# EasyEDA Pro project tachyon.eprj, schematic backing-board-schematic

## Sheets
1 MCU: Board Name: backing-board; Create Date: 2026-04-17; Page Name: MCU; Project Name: tachyon; Schematic Name: backing-board-schematic; Update Date: 2026-04-29; Company: EasyEDA.com; Page Size: A4; Version: V1.0
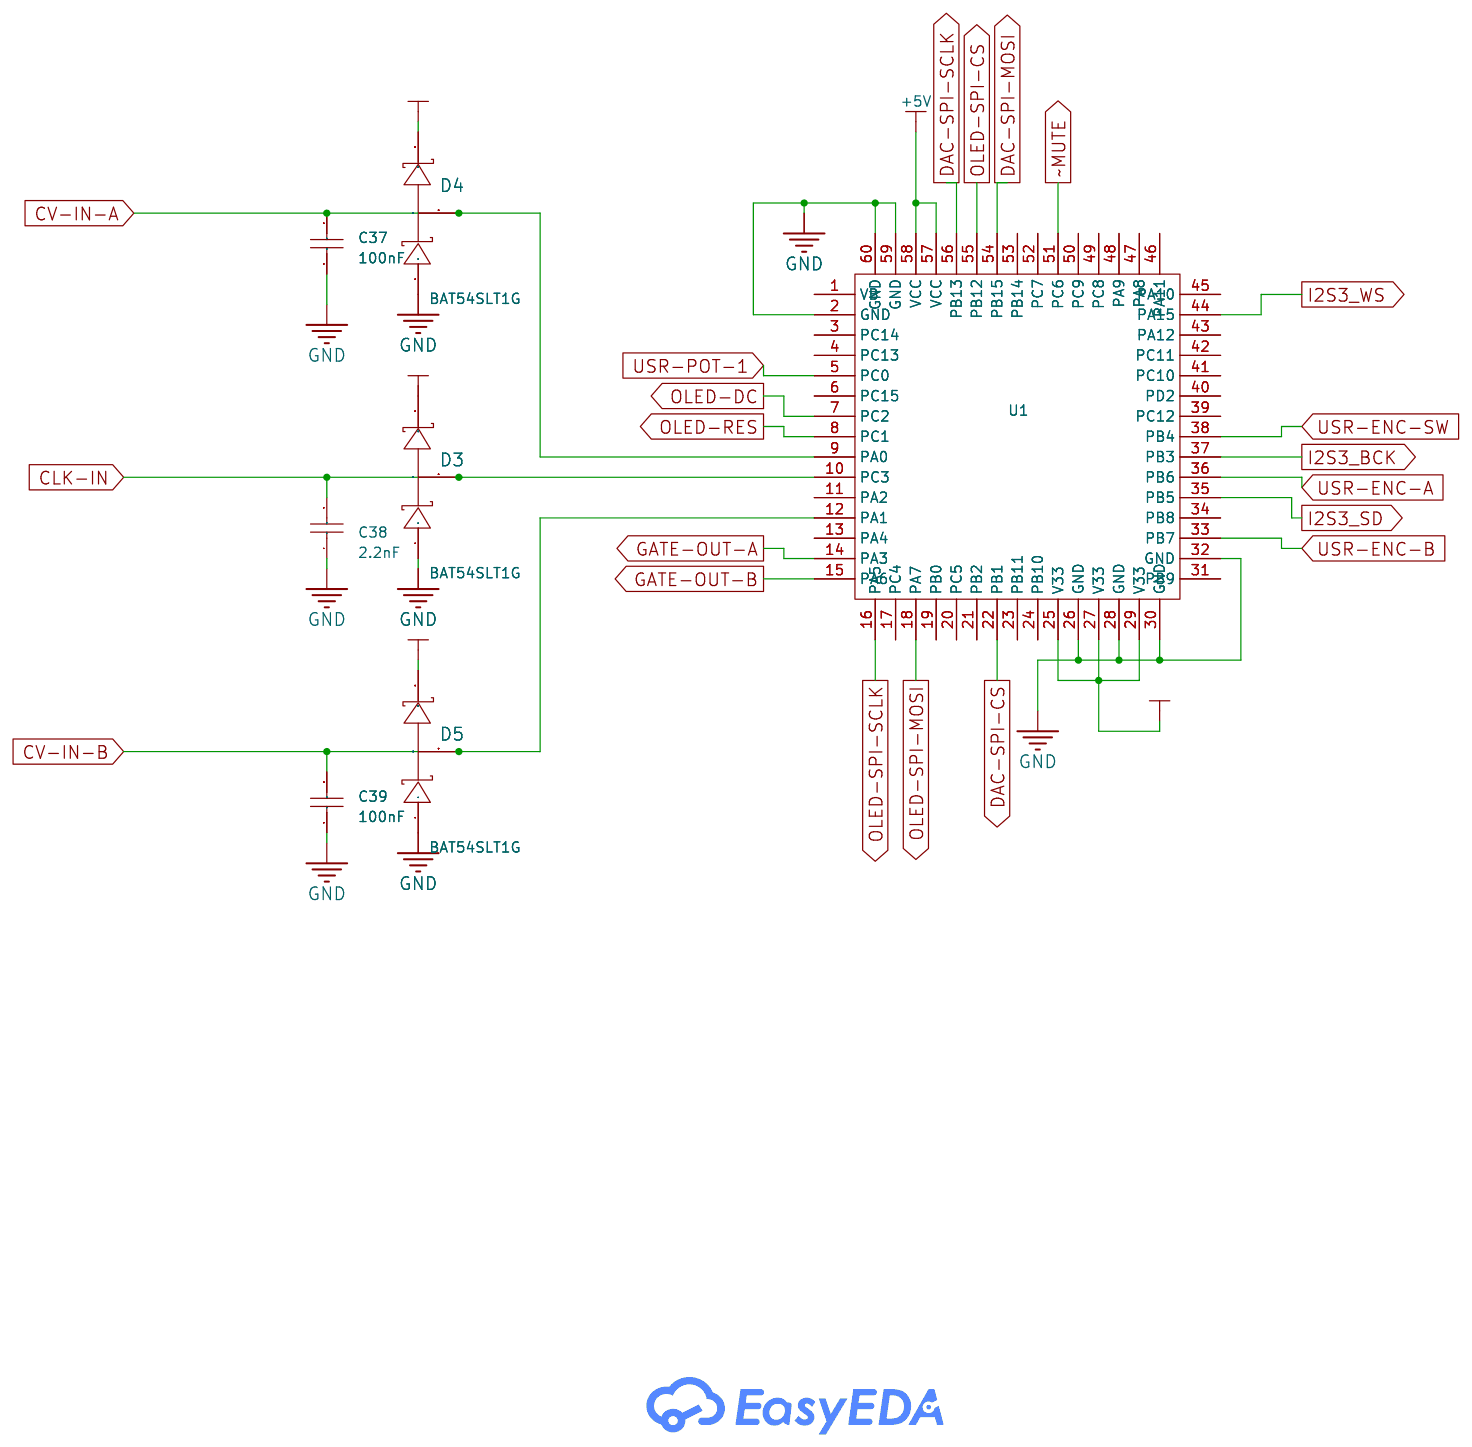
[diagram p2: MCU]
2 Audio: Page Name: Audio; Update Date: 2026-04-20
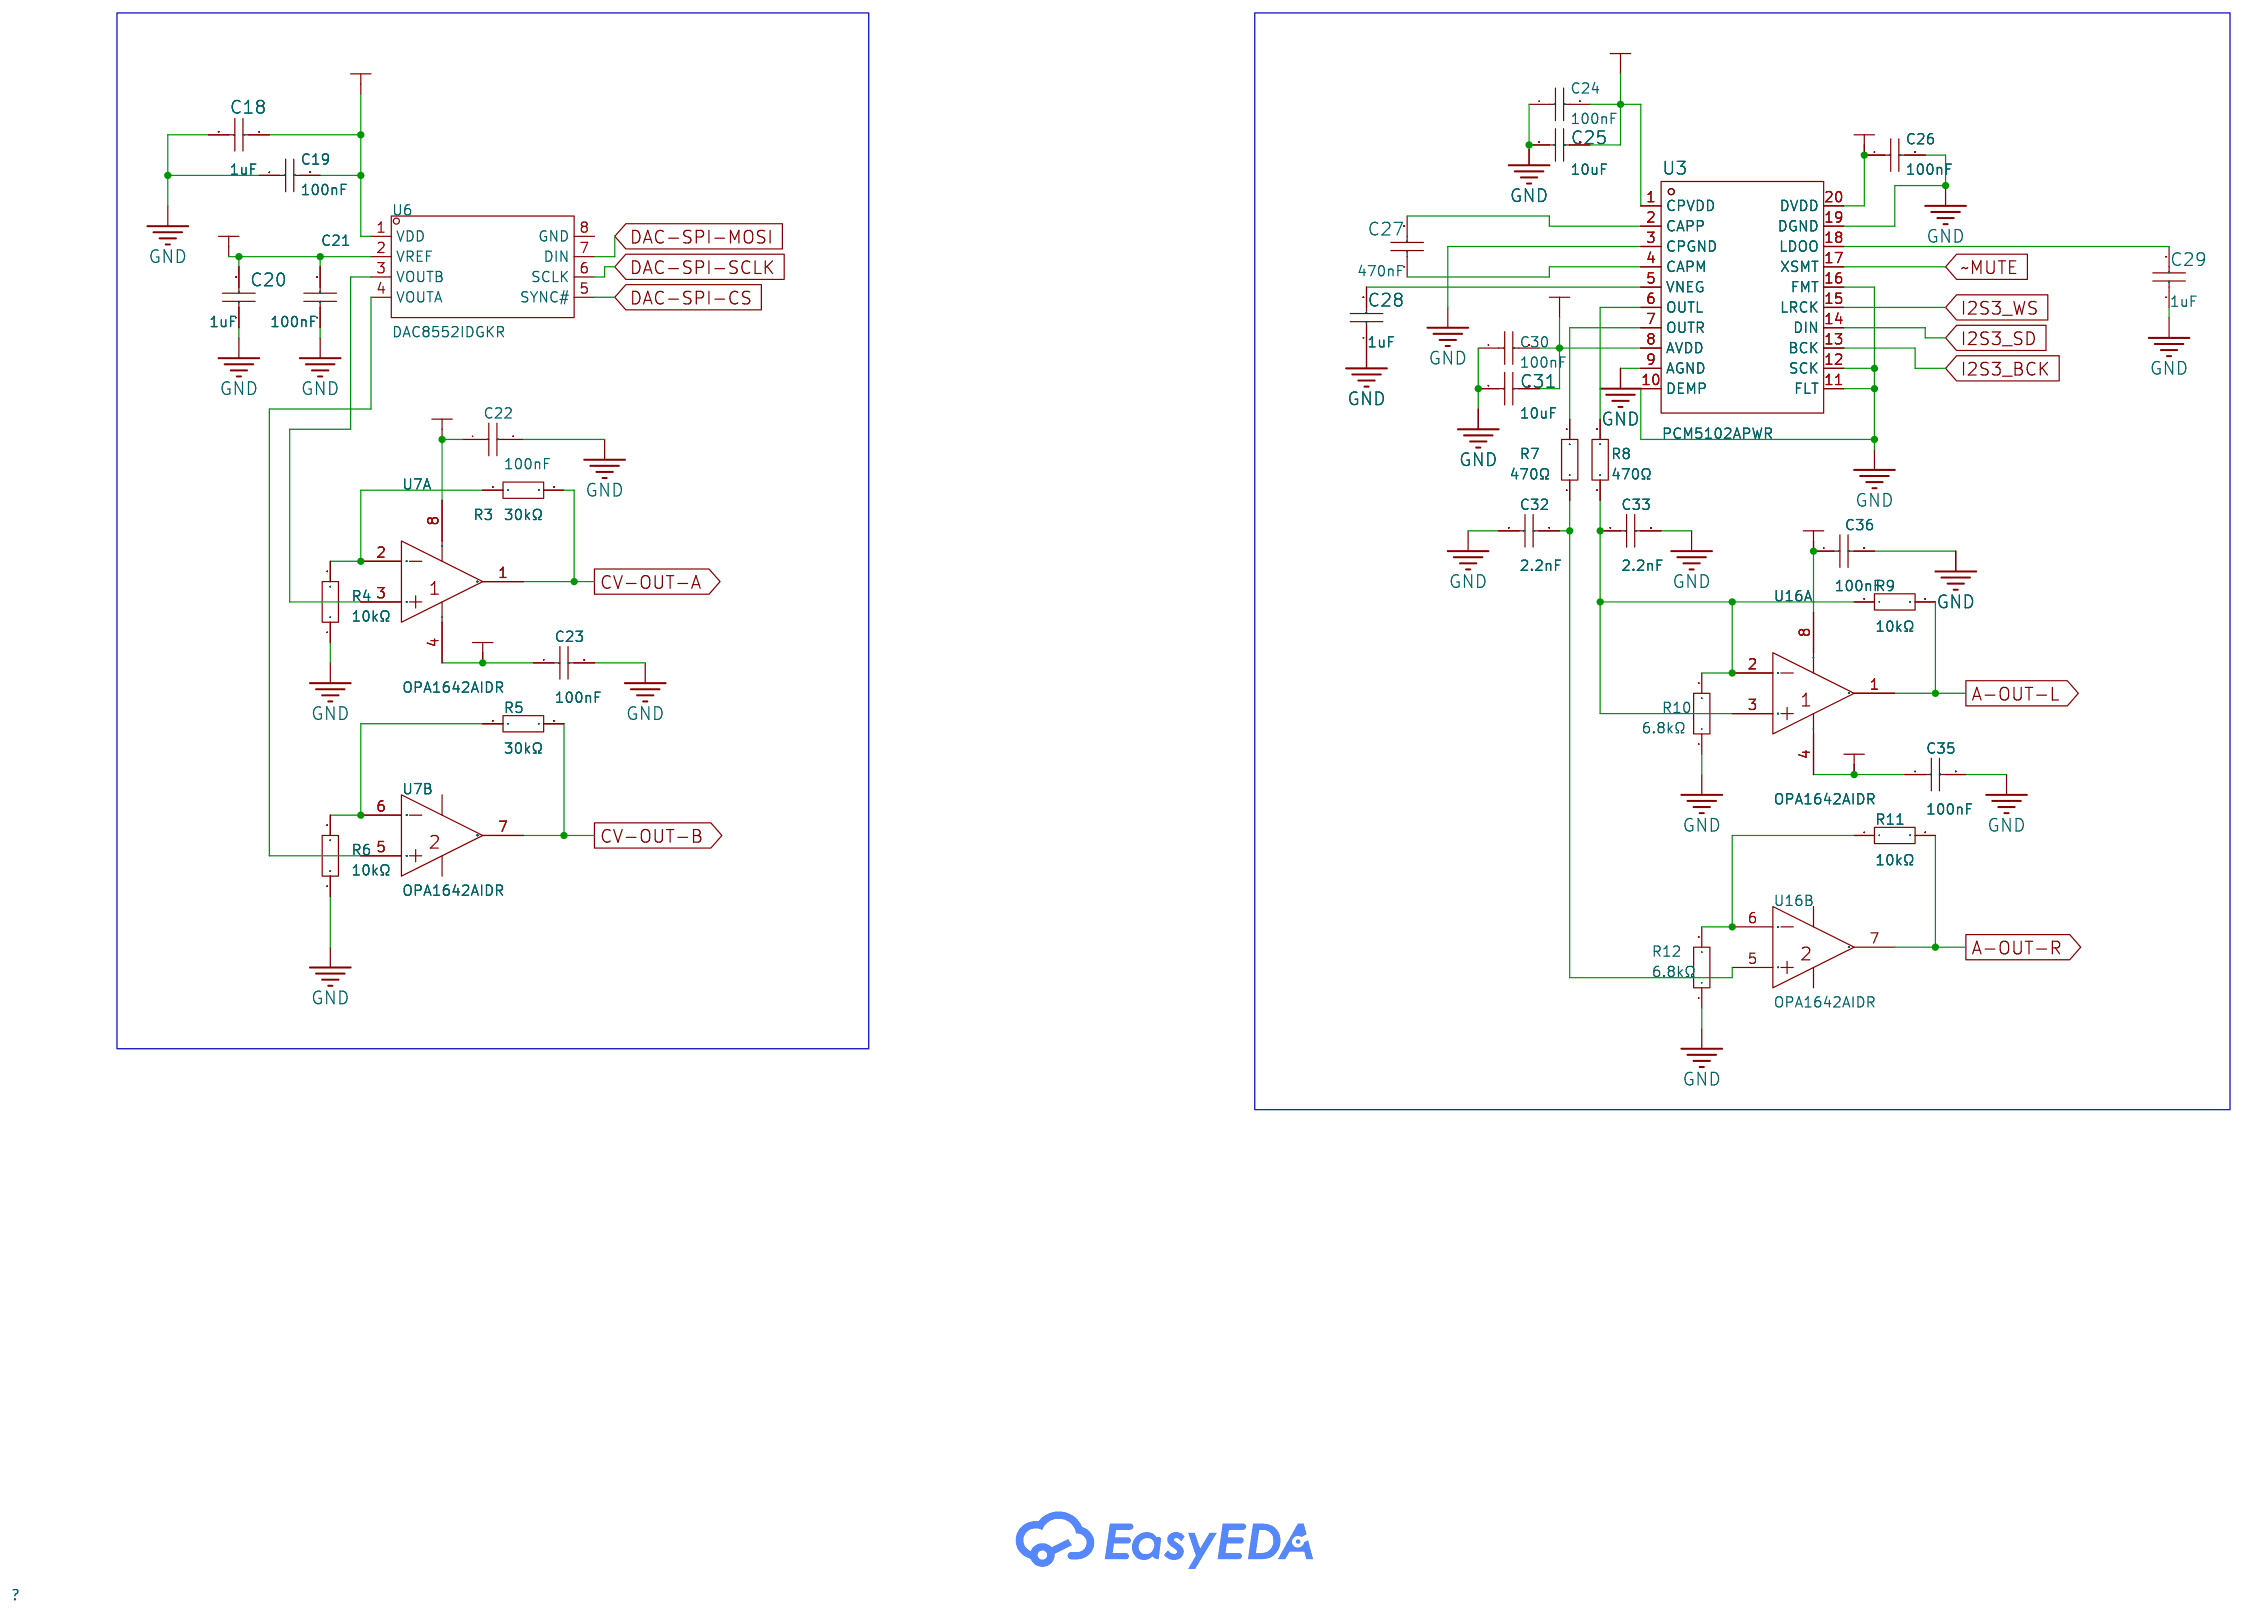
[diagram p3: Audio]
3 Interconnect: Page Name: Interconnect; Update Date: 2026-04-21
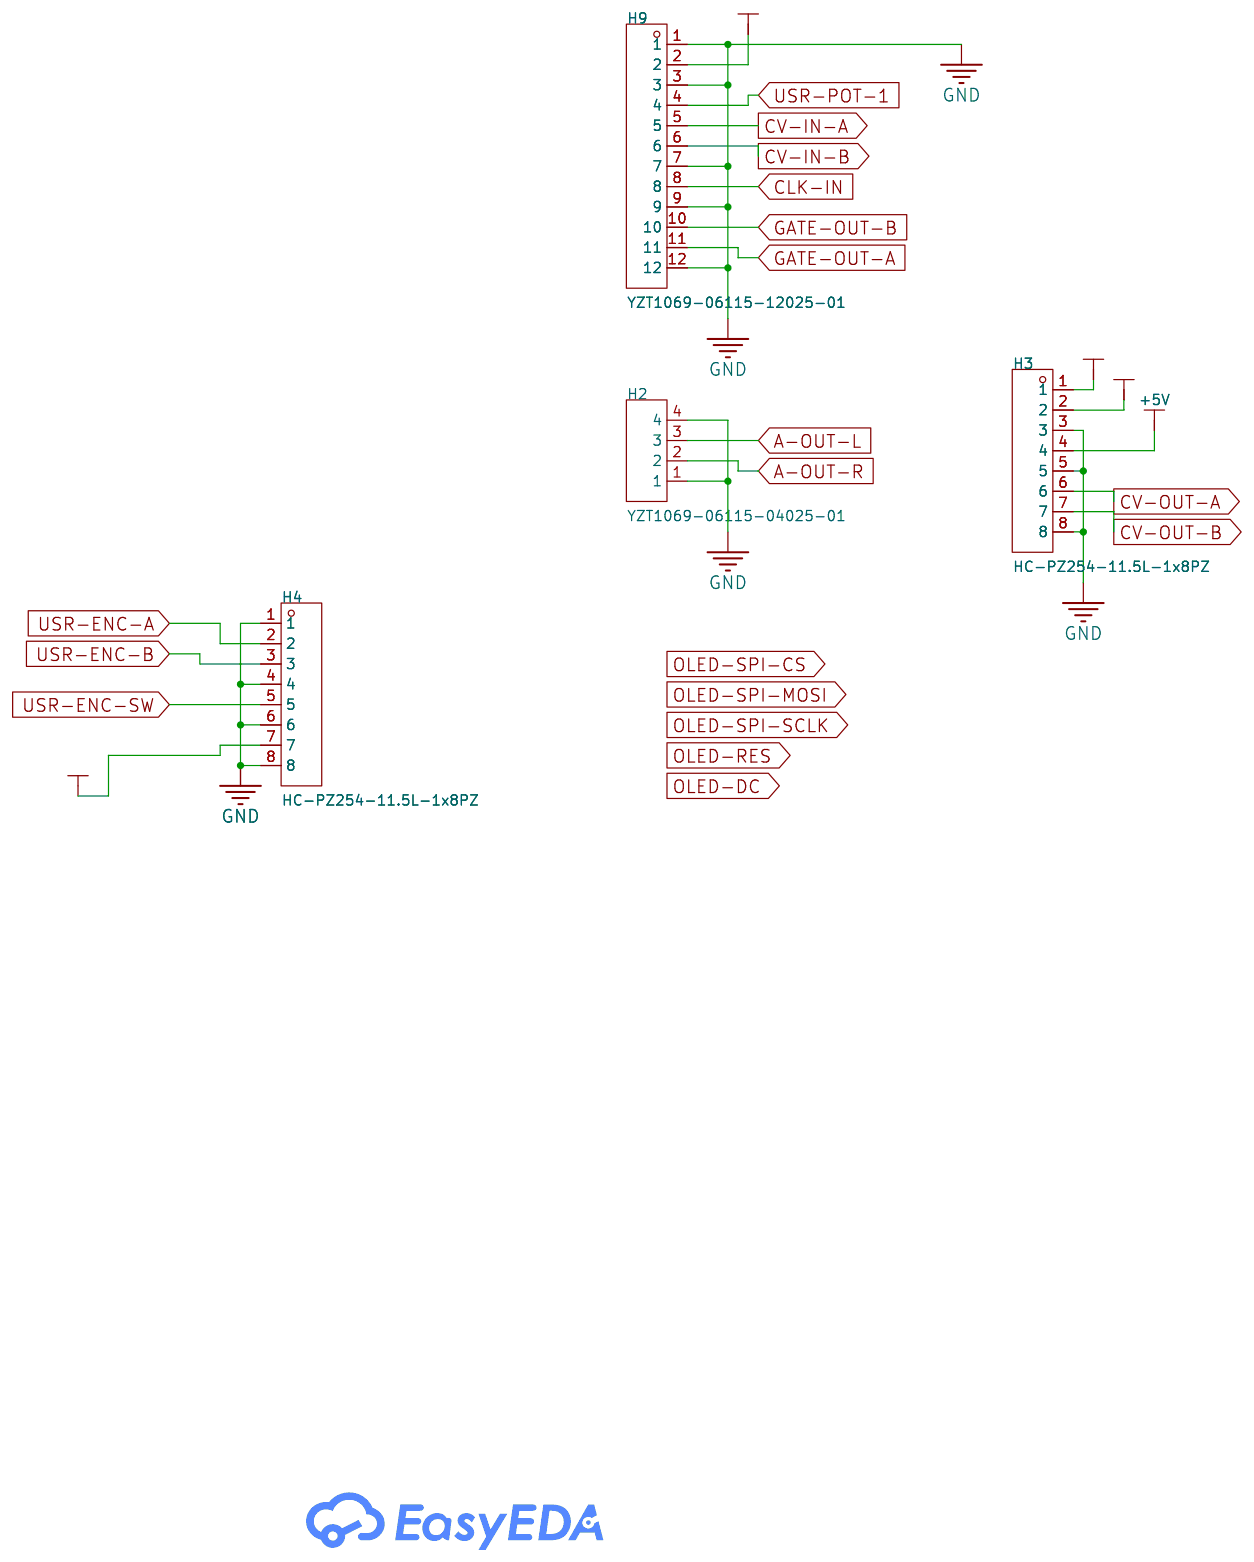
[diagram p4: Interconnect]
4 Power: Page Name: Power; Update Date: 2026-04-19
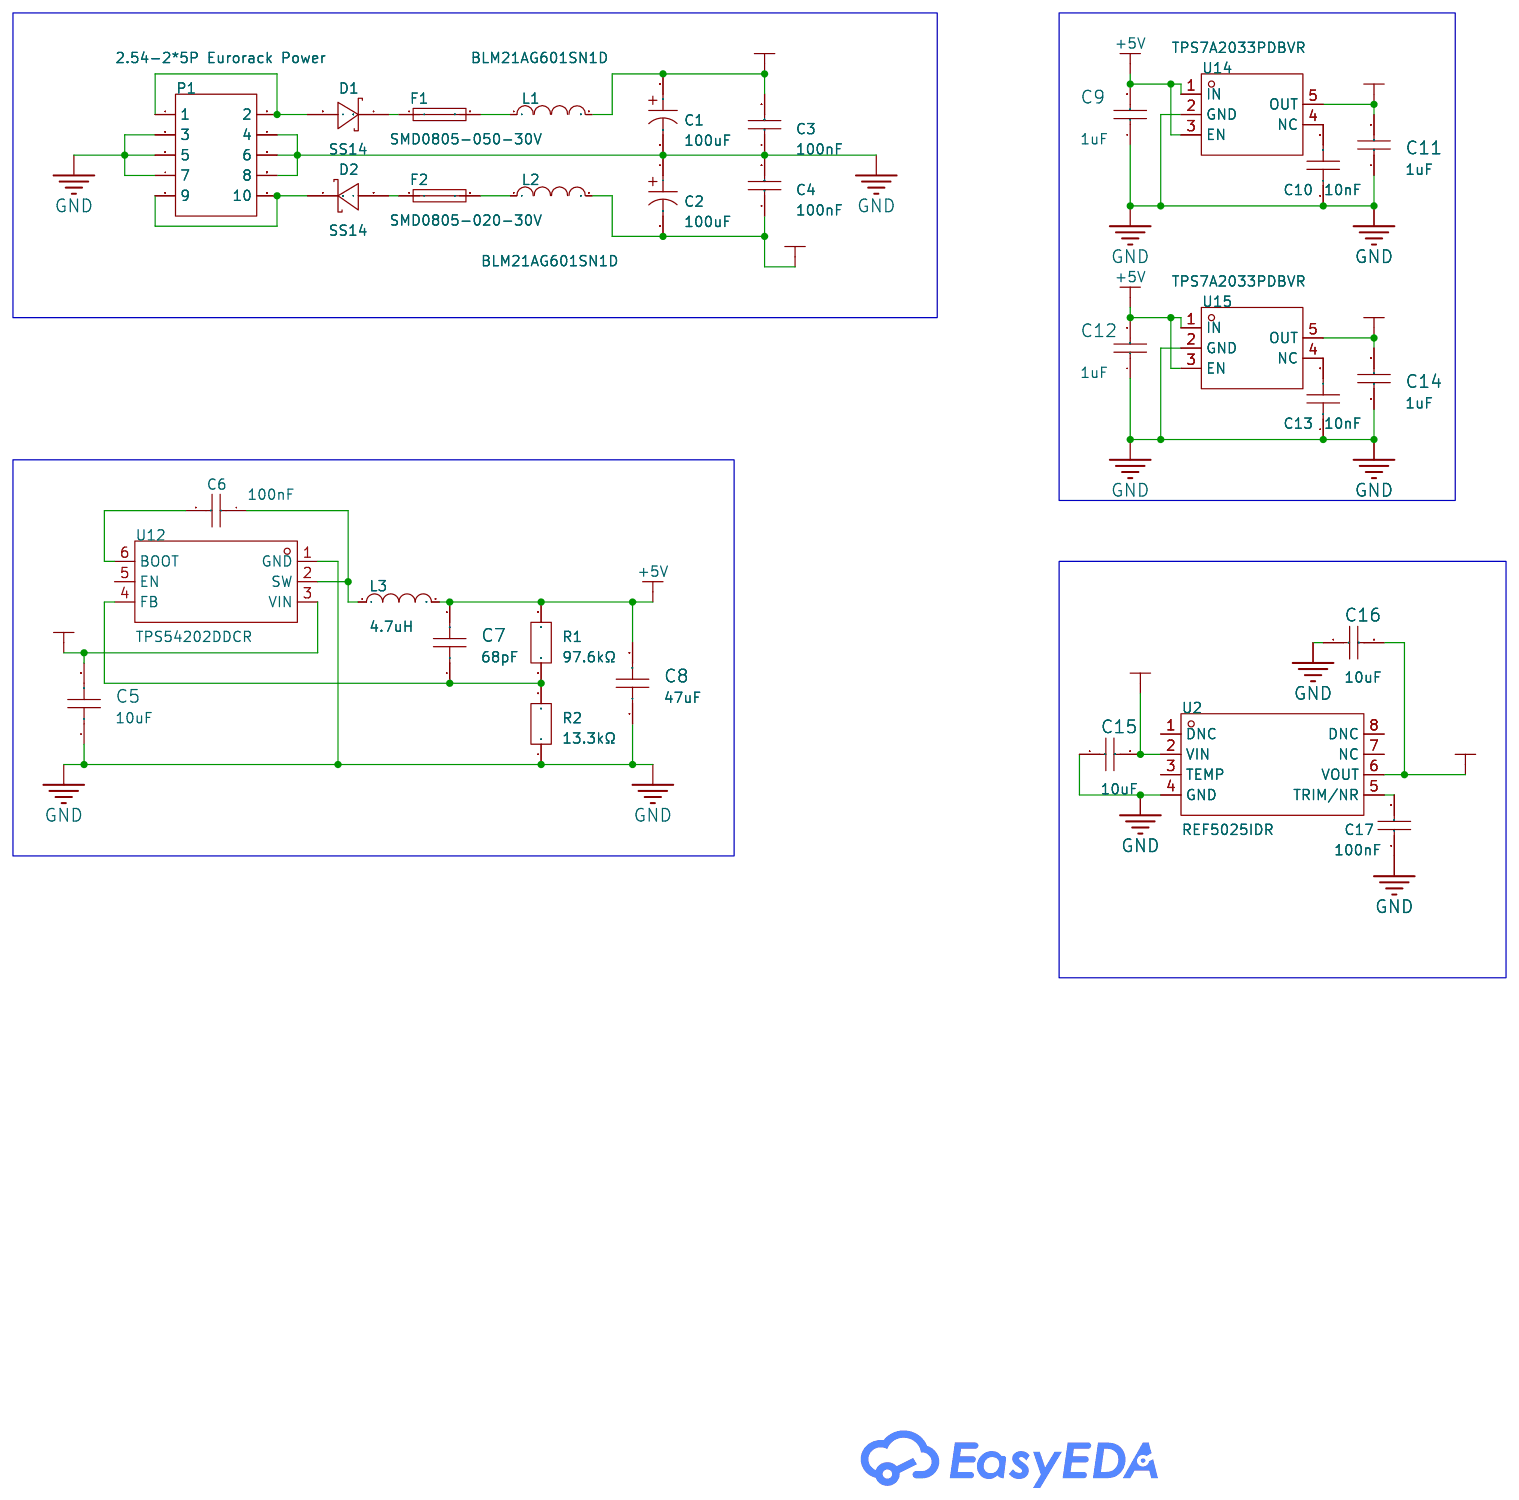
[diagram p5: Power]

## Parts
sheet Audio
C18  1uF  [C0805]
C19  100nF  [C0805]
C20  1uF  [C0805]
C21  100nF  [C0805]
C22  100nF  [C0805]
C23  100nF  [C0805]
C24  100nF  [C0805]
C25  10uF  [C0805]
C26  100nF  [C0805]
C27  470nF  [C0805]
C28  1uF  [C0805]
C29  1uF  [C0805]
C30  100nF  [C0805]
C31  10uF  [C0805]
C32  2.2nF  [C0805]
C33  2.2nF  [C0805]
C35  100nF  [C0805]
C36  100nF  [C0805]
R3  30kΩ  [R0805]
R4  10kΩ  [R0805]
R5  30kΩ  [R0805]
R6  10kΩ  [R0805]
R7  470Ω  [R0805]
R8  470Ω  [R0805]
R9  10kΩ  [R0805]
R10  6.8kΩ  [R0805]
R11  10kΩ  [R0805]
R12  6.8kΩ  [R0805]
U3  PCM5102APWR  [TSSOP-20_L6.5-W4.4-P0.65-LS6.4-BL]
U6  DAC8552IDGKR  [VSSOP-8_L3.0-W3.0-P0.65-LS5.0-BL]
U7  OPA1642AIDR  [SOIC-8_L4.9-W3.9-P1.27-LS6.0-BL]  (sections 1,2)
U16  OPA1642AIDR  [SOIC-8_L4.9-W3.9-P1.27-LS6.0-BL]  (sections 1,2)
sheet Interconnect
H2  YZT1069-06115-04025-01  [HDR-TH_4P-P2.54-V-M-1]
H3  HC-PZ254-11.5L-1x8PZ  [HDR-TH_8P-P2.54-V-M]
H4  HC-PZ254-11.5L-1x8PZ  [HDR-TH_8P-P2.54-V-M]
H9  YZT1069-06115-12025-01  [HDR-TH_12P-P2.54-V-M]
sheet MCU
C37  100nF  [C0805]
C38  2.2nF  [C0805]
C39  100nF  [C0805]
D3  BAT54SLT1G  [SOT-23_L2.9-W1.3-P1.90-LS2.4-BR]
D4  BAT54SLT1G  [SOT-23_L2.9-W1.3-P1.90-LS2.4-BR]
D5  BAT54SLT1G  [SOT-23_L2.9-W1.3-P1.90-LS2.4-BR]
U1  WeAct-STM32F405RGT6  [Library:WeAct STM32F405RGT6]
sheet Power
C1  100uF  [CAP-SMD_BD6.3-L6.6-W6.6-LS7.2-FD]
C2  100uF  [CAP-SMD_BD6.3-L6.6-W6.6-LS7.2-FD]
C3  100nF  [C0805]
C4  100nF  [C0805]
C5  10uF  [C0805]
C6  100nF  [C0805]
C7  68pF  [C0805]
C8  47uF  [C1210]
C9  1uF  [C0805]
C10  10nF  [C0805]
C11  1uF  [C0805]
C12  1uF  [C0805]
C13  10nF  [C0805]
C14  1uF  [C0805]
C15  10uF  [C0805]
C16  10uF  [C0805]
C17  100nF  [C0805]
D1  SS14  [SMA_L4.4-W2.6-LS5.0-RD]
D2  SS14  [SMA_L4.4-W2.6-LS5.0-RD]
F1  SMD0805-050-30V  [F0805]
F2  SMD0805-020-30V  [F0805]
L1  BLM21AG601SN1D  [L0805]
L2  BLM21AG601SN1D  [L0805]
L3  4.7uH  [IND-SMD_L2.5-W2.0_MPB252012T]
P1  2.54-2*5P Eurorack Power  [IDC-TH_10P-P2.54_C5665]
R1  97.6kΩ  [R0805]
R2  13.3kΩ  [R0805]
U2  REF5025IDR  [SOIC-8_L4.9-W3.9-P1.27-LS6.0-BL-4]
U12  TPS54202DDCR  [SOT-23-6_L2.9-W1.6-P0.95-LS2.8-BL]
U14  TPS7A2033PDBVR  [SOT-23-5_L2.9-W1.6-P0.95-LS2.8-BR]
U15  TPS7A2033PDBVR  [SOT-23-5_L2.9-W1.6-P0.95-LS2.8-BR]

## Library data of the parts
C9 C11 C12 C14 C18 C20 C28 C29 = CC0805KKX7R9BB105: Capacitance: Tolerance:±10% Tolerance:±10% Voltage Rated: Temperature Coefficient:; LCSC Part Name: 1uF ±10% 50V; Supplier Part: C91185; Manufacturer: YAGEO(国巨); Supplier Footprint: 0805; JLCPCB Part Class: Extended Part; Datasheet: https://atta.szlcsc.com/upload/public/pdf/source/20181008/C309510_22F155564471FAF6A489F7D68F34234E.pdf; Supplier: LCSC; Tolerance: ±10%
C3 C4 C6 C17 C19 C21-C24 C26 C30 C35-C37 C39 = CL21B104KBCNNNC: Capacitance:100nF Tolerance:±10% Tolerance:±10% Voltage Rating:50V Temperature Coefficient:X7R; LCSC Part Name: 100nF ±10% 50V; Supplier Part: C1711; Manufacturer: SAMSUNG(三星); Supplier Footprint: 0805; JLCPCB Part Class: Extended Part; Datasheet: https://item.szlcsc.com/datasheet/CL21B104KBCNNNC/2063.html; Supplier: LCSC; Tolerance: ±10%; Voltage Rating: 50V; Temperature Coefficient: X7R
C15 C16 C25 C31 = CL21A106KOQNNNE: Capacitance:10uF Tolerance:±10% Tolerance:±10% Voltage Rating:16V Temperature Coefficient:X5R; LCSC Part Name: 10uF ±10% 16V; Supplier Part: C1713; Manufacturer: SAMSUNG(三星); Supplier Footprint: 0805; JLCPCB Part Class: Extended Part; Datasheet: https://item.szlcsc.com/datasheet/CL21A106KOQNNNE/2065.html; Supplier: LCSC; Tolerance: ±10%; Voltage Rating: 16V; Temperature Coefficient: X5R
C27 = CC0805KKX7R9BB105: Capacitance: Tolerance:±10% Tolerance:±10% Voltage Rated: Temperature Coefficient:; LCSC Part Name: 1uF ±10% 50V; Supplier Part: C106843; Manufacturer: YAGEO(国巨); Manufacturer Part: CC0805KKX7R9BB474; Supplier Footprint: 0805; JLCPCB Part Class: Extended Part; Datasheet: https://atta.szlcsc.com/upload/public/pdf/source/20181008/C309510_22F155564471FAF6A489F7D68F34234E.pdf; Supplier: LCSC; Tolerance: ±10%
C32 C33 = CC0805JKNPO9BN222: LCSC Part Name: 2.2nF ±5% 50V; Supplier Part: C107103; Manufacturer: YAGEO(国巨); Supplier Footprint: 0805; JLCPCB Part Class: Extended Part; Datasheet: https://item.szlcsc.com/datasheet/CC0805JKNPO9BN222/108319.html; Supplier: LCSC; Tolerance: ±5%; Voltage Rating: 50V; Temperature Coefficient: NP0
R3 R5 = AC0805FR-0730KL: LCSC Part Name: 厚膜电阻 30kΩ ±1% 125mW; Supplier Part: C144565; Manufacturer: YAGEO(国巨); Supplier Footprint: 0805; JLCPCB Part Class: Extended Part; Datasheet: https://atta.szlcsc.com/upload/public/pdf/source/20180927/C229861_4ABDC471507C1ED6AFB4BA66AFC8620A.pdf; Supplier: LCSC; Type: Thick Film Resistors; Tolerance: ±1%; Temperature Coefficient: ±100ppm/℃; Operating Temperature Range: -55℃~+155℃
R4 R6 R9 R11 = AC0805FR-0710KL: LCSC Part Name: 厚膜电阻 10kΩ ±1% 125mW; Supplier Part: C140868; Manufacturer: YAGEO(国巨); Supplier Footprint: 0805; JLCPCB Part Class: Extended Part; Datasheet: https://item.szlcsc.com/datasheet/AC0805FR-0710KL/152196.html; Supplier: LCSC; Type: Thick Film Resistor; Tolerance: ±1%; Power(Watts): 125mW; Voltage-Supply(Max): 150V; Temperature Coefficient: ±100ppm/℃; Operating Temperature: -55℃~+155℃
R7 R8 = AC0805FR-07470RL: LCSC Part Name: 厚膜电阻 470Ω ±1% 125mW; Supplier Part: C144560; Manufacturer: YAGEO(国巨); Supplier Footprint: 0805; JLCPCB Part Class: Extended Part; Datasheet: https://item.szlcsc.com/datasheet/AC0805FR-07470RL/155892.html; Supplier: LCSC; Type: Thick Film Resistor; Tolerance: ±1%; Power(Watts): 125mW; Voltage-Supply(Max): 150V; Temperature Coefficient: ±100ppm/℃; Operating Temperature: -55℃~+155℃
R10 R12 = AC0805FR-076K8L: LCSC Part Name: 厚膜电阻 6.8kΩ ±1% 125mW; Supplier Part: C144547; Manufacturer: YAGEO(国巨); Supplier Footprint: 0805; JLCPCB Part Class: Extended Part; Datasheet: https://atta.szlcsc.com/upload/public/pdf/source/20180927/C229861_4ABDC471507C1ED6AFB4BA66AFC8620A.pdf; Supplier: LCSC; Type: Thick Film Resistors; Tolerance: ±1%; Temperature Coefficient: ±100ppm/℃; Operating Temperature Range: -55℃~+155℃
U3 = PCM5102APWR: Interface Type:PCM Supply Voltage:1.65V~3.46V Supply Voltage:1.65V~3.46V Number of Channels:2 Resolution:24；16；32 Operating Temperature:-25℃~+85℃ Operating Temperature:-25℃~+85℃; Supplier Part: C107671; Manufacturer: TI(德州仪器); Supplier Footprint: TSSOP-20; JLCPCB Part Class: Extended Part; Datasheet: https://www.ti.com/cn/lit/gpn/pcm5102a; Supplier: LCSC; Interface Type: PCM; Supply Voltage: 1.65V~3.46V; Number of Channels: 2; Resolution: 24；16；32; Operating Temperature: -25℃~+85℃
U6 = DAC8552IDGKR: Resolution(Bits):16 Number of Channels:2 Interface:SPI Voltage - Supply:2.7V~5.5V Voltage - Supply:2.7V~5.5V Settling Time:10us Output Type:Voltage Buffer Integral non - linearity:4LSB Integral non - linearity:4LSB Operating Temperature:-40℃~+105℃ Operati; LCSC Part Name: 16位、双通道、电压输出数模转换器; Supplier Part: C136020; Manufacturer: TI(德州仪器); Supplier Footprint: MSOP-8; JLCPCB Part Class: Extended Part; Datasheet: https://www.ti.com/cn/lit/gpn/dac8552; Supplier: LCSC; Resolution(Bits): 16; Number of Channels: 2; Interface: SPI; Voltage - Supply: 2.7V~5.5V; Settling Time: 10us; Output Type: Voltage Buffer; Integral non - linearity: 4LSB; Operating Temperature: -40℃~+105℃; Power-On Reset: Built-in; Voltage Reference: External; Quiescent Current (Iq): 700nA
U7 U16 = OPA1642AIDR: Class:- Speaker Channels:2-Channel Output Power:- Total Harmonic Distortion + Noise (THD+N):0.00005% Quiescent Current:1.8mA Signal-to-Noise Ratio:- Power Supply Rejection Ratio (PSRR):- Efficiency:- Number of Inputs:2 Pairs Differential Inputs Features:-; LCSC Part Name: OPA164x 声加高性能、结型场效应晶体管输入音频运算放大器; Supplier Part: C67640; Manufacturer: TI(德州仪器); Supplier Footprint: SOIC-8; JLCPCB Part Class: Extended Part; Datasheet: https://www.ti.com/cn/lit/gpn/opa1642; Supplier: LCSC; Speaker Channels: 2-Channel; Total Harmonic Distortion + Noise (THD+N): 0.00005%; Quiescent Current: 1.8mA; Number of Inputs: 2 Pairs Differential Inputs; Voltage - Supply: 2.25V~18V；-18V~-2.25V; Operating Temperature: -40℃~+85℃
H2 = YZT1069-06115-04025-01: LCSC Part Name: 1x4P 间距:2.54mm 方针 直插; Supplier Part: C22368214; Manufacturer: Xinyangze(鑫扬泽); Supplier Footprint: 插件,P=2.54mm; JLCPCB Part Class: Extended Part; Datasheet: https://item.szlcsc.com/datasheet/YZT1069-06115-04025-01/23843841.html; Supplier: LCSC; Pin Structure: 1x4P; Pitch: 2.54mm; Circluar Pins/Square Pins: Pin Header; Mounting Type: Through Hole; Number of Rows: 1; Number of Pins: 4P; Current Rating: 3A; Length of Mating Pin: 6mm; Insulation Height: 2.54mm; Length of End Connection Pin: 3mm; Contact Material: Copper Alloy; Contact Plating: Gold; Operating Temperature: -25℃~+105℃
H3 H4 = HC-PZ254-11.5L-1x8PZ: LCSC Part Name: 1x8P 间距:2.54mm 方针 直插; Supplier Part: C27985192; Manufacturer: HC(虹成电子); Supplier Footprint: 插件,P=2.54mm; JLCPCB Part Class: Extended Part; Datasheet: https://item.szlcsc.com/datasheet/HC-PZ254-11.5L-1x8PZ/29721150.html; Supplier: LCSC; Pin Structure: 1x8P; Pitch: 2.54mm; Circluar Pins/Square Pins: Pin Header; Mounting Type: Through Hole; Number of Rows: 1; Number of Pins: 8P; Current Rating: 3A; Length of Mating Pin: 6mm; Insulation Height: 2.5mm; Length of End Connection Pin: 3mm; Contact Material: Brass; Contact Plating: Gold; Operating Temperature: -40℃~+105℃; Color: Black
H9 = YZT1069-06115-12025-01: LCSC Part Name: 1x12P 间距:2.54mm 方针 直插; Supplier Part: C22368219; Manufacturer: Xinyangze(鑫扬泽); Supplier Footprint: 插件,P=2.54mm; JLCPCB Part Class: Extended Part; Datasheet: https://item.szlcsc.com/datasheet/YZT1069-06115-12025-01/23843846.html; Supplier: LCSC; Pin Structure: 1x12P; Pitch: 2.54mm; Circluar Pins/Square Pins: Pin Header; Mounting Type: Through Hole; Number of Rows: 1; Number of Pins: 12P; Current Rating: 3A; Length of Mating Pin: 6mm; Insulation Height: 2.54mm; Length of End Connection Pin: 3mm; Contact Material: Copper Alloy; Contact Plating: Gold; Operating Temperature: -25℃~+105℃
C38 = CC0805JKNPO9BN222: Capacitance:2.2nF Tolerance:±5% Tolerance:±5% Voltage Rating:50V Temperature Coefficient:NP0; LCSC Part Name: 2.2nF ±5% 50V; Supplier Part: C107103; Manufacturer: YAGEO(国巨); Supplier Footprint: 0805; JLCPCB Part Class: Extended Part; Datasheet: https://item.szlcsc.com/datasheet/CC0805JKNPO9BN222/108319.html; Supplier: LCSC; Tolerance: ±5%; Voltage Rating: 50V; Temperature Coefficient: NP0
D3-D5 = BAT54SLT1G: Diode Configuration:1 Pair Series Connection Voltage - Forward(Vf@If):800mV@100mA Voltage - DC Reverse(Vr):30V Current - Rectified:200mA Reverse Leakage Current (Ir):2uA@25V Operating Junction Temperature Range:-55℃~+150℃ Operating Junction Temperature Ra; LCSC Part Name: 电压:30V 电流:200mA; Supplier Part: C19726; Manufacturer: onsemi(安森美); Supplier Footprint: SOT-23; JLCPCB Part Class: Extended Part; Datasheet: https://item.szlcsc.com/datasheet/BAT54SLT1G/20435.html; Supplier: LCSC; Diode Configuration: 1 Pair Series Connection; Voltage - Forward(Vf@If): 800mV@100mA; Voltage - DC Reverse(Vr): 30V; Current - Rectified: 200mA; Reverse Leakage Current (Ir): 2uA@25V; Operating Junction Temperature Range: -55℃~+150℃
U1 = WeAct-STM32F405RGT6
C1 C2 = RVT1C101M0605 100UF 16V: Capacitance:100uF Tolerance:±20% Tolerance:±20% Voltage Rating:16V Ripple Current:63mA@120Hz Equivalent Series Resistance(ESR):- Diameter:6.3mm Height - Seated (Max):5.4mm Lifetime:2800hrs@105℃ Operating Temperature:-55℃~+105℃ Operating Temperature:-55℃~+; LCSC Part Name: 100uF ±20% 16V; Supplier Part: C970684; Manufacturer: DMBJ(振宝佳); Supplier Footprint: SMD,D6.3xL5.4mm; JLCPCB Part Class: Extended Part; Datasheet: https://item.szlcsc.com/datasheet/RVT1C101M0605%2520100UF%252016V/1060412.html; Supplier: LCSC; Tolerance: ±20%; Voltage Rating: 16V; Ripple Current: 63mA@120Hz; Diameter: 6.3mm; Height - Seated (Max): 5.4mm; Lifetime: 2800hrs@105℃; Operating Temperature: -55℃~+105℃
C5 = GRM21BR61E106KA73L: Capacitance:10uF Tolerance:±10% Tolerance:±10% Voltage Rating:25V Temperature Coefficient:X5R; LCSC Part Name: 10uF ±10% 25V; Supplier Part: C84416; Manufacturer: muRata(村田); Supplier Footprint: 0805; JLCPCB Part Class: Extended Part; Datasheet: https://item.szlcsc.com/datasheet/GRM21BR61E106KA73L/85586.html; Supplier: LCSC; Tolerance: ±10%; Voltage Rating: 25V; Temperature Coefficient: X5R
C7 = CC0805FRNPO9BN680: Capacitance:68pF Tolerance:±1% Tolerance:±1% Voltage Rating:50V Temperature Coefficient:NP0; LCSC Part Name: 68pF ±1% 50V; Supplier Part: C541517; Manufacturer: YAGEO(国巨); Supplier Footprint: 0805; JLCPCB Part Class: Extended Part; Datasheet: https://item.szlcsc.com/datasheet/CC0805FRNPO9BN680/562013.html; Supplier: LCSC; Tolerance: ±1%; Voltage Rating: 50V; Temperature Coefficient: NP0
C8 = GRM32ER61C476KE15L: Capacitance:47uF Tolerance:±10% Tolerance:±10% Voltage Rating:16V Temperature Coefficient:X5R; LCSC Part Name: 47uF ±10% 16V; Supplier Part: C77101; Manufacturer: muRata(村田); Supplier Footprint: 1210; JLCPCB Part Class: Extended Part; Datasheet: https://item.szlcsc.com/datasheet/GRM32ER61C476KE15L/78228.html; Supplier: LCSC; Tolerance: ±10%; Voltage Rating: 16V; Temperature Coefficient: X5R
C10 C13 = CC0805KRX7R9BB103: LCSC Part Name: 10nF ±10% 50V; Supplier Part: C83170; Manufacturer: YAGEO(国巨); Supplier Footprint: 0805; JLCPCB Part Class: Extended Part; Datasheet: https://item.szlcsc.com/datasheet/CC0805KRX7R9BB103/84334.html; Supplier: LCSC; Tolerance: ±10%; Voltage Rating: 50V; Temperature Coefficient: X7R
D1 D2 = SS14_C48782961: Voltage - Forward(Vf@If):700mV@1A Voltage - DC Reverse(Vr):40V Current - Rectified:1A Operating Junction Temperature Range:-55℃~+150℃ Operating Junction Temperature Range:-55℃~+150℃ Non-Repetitive Peak Forward Surge Current:30A; LCSC Part Name: 40V 1A; Supplier Part: C48782961; Manufacturer: HT(金誉); Supplier Footprint: SMA; JLCPCB Part Class: Extended Part; Datasheet: https://item.szlcsc.com/datasheet/SS14/51079493.html; Supplier: LCSC; Voltage - Forward(Vf@If): 700mV@1A; Voltage - DC Reverse(Vr): 40V; Current - Rectified: 1A; Operating Junction Temperature Range: -55℃~+150℃; Non-Repetitive Peak Forward Surge Current: 30A
F1 = SMD0805-050-30V: LCSC Part Name: 30V,0.50A; Supplier Part: C42924282; Manufacturer: 台湾陆海; Supplier Footprint: 0805; JLCPCB Part Class: Extended Part; Datasheet: https://item.szlcsc.com/datasheet/SMD0805-050-30V/45024612.html; Supplier: LCSC; Voltage - Max: 30V; Hold Current: 500mA; Trip Current: 1A; Power Dissipation: 500mW; Resistance - Initial (Ri) (Min): 150mΩ; Resistance - Post Trip (R1) (Max): 850mΩ; Time to Trip(Max): 100ms; Operating Temperature: -40℃~+85℃
F2 = SMD0805-020-30V: LCSC Part Name: 30V 0.2A; Supplier Part: C6851465; Manufacturer: 台湾陆海; Supplier Footprint: 0805; JLCPCB Part Class: Extended Part; Datasheet: https://item.szlcsc.com/datasheet/SMD0805-020-30V/7814950.html; Supplier: LCSC; Voltage - Max: 30V; Current - Max: 100A; Hold Current: 200mA; Trip Current: 500mA; Power Dissipation: 500mW; Resistance - Initial (Ri) (Min): 650mΩ; Resistance - Post Trip (R1) (Max): 3.5Ω; Time to Trip(Max): 20ms
L1 L2 = BLM21AG601SN1D: Impedance @ Frequency:600Ω@100MHz Tolerance:±25% Tolerance:±25% DC Resistance(DCR):210mΩ Current Rating:700mA Number of Circuits:1 Operating Temperature:-55℃~+125℃ Operating Temperature:-55℃~+125℃; LCSC Part Name: 单路 0805磁珠 阻抗600Ω@100MHz; Supplier Part: C85837; Manufacturer: muRata(村田); Supplier Footprint: 0805; JLCPCB Part Class: Extended Part; Datasheet: https://item.szlcsc.com/datasheet/BLM21AG601SN1D/87013.html; Supplier: LCSC; Impedance @ Frequency: 600Ω@100MHz; Tolerance: ±25%; DC Resistance(DCR): 210mΩ; Current Rating: 700mA; Number of Circuits: 1; Operating Temperature: -55℃~+125℃
L3 = DFE252012F-4R7M=P2: Inductance:4.7uH Tolerance:±20% Tolerance:±20% Current Rating:1.5A Current - Saturation(Isat):2.1A DC Resistance(DCR):190mΩ; LCSC Part Name: 4.7uH ±20% 2.1A; Supplier Part: C668313; Manufacturer: muRata(村田); Supplier Footprint: 1008; JLCPCB Part Class: Extended Part; Datasheet: https://atta.szlcsc.com/upload/public/pdf/source/20200716/C703141_C4AFEA7D31E0931E23F948A8B91A9E18.pdf; Supplier: LCSC; Tolerance: ±20%; Current Rating: 1.5A; Current - Saturation(Isat): 2.1A; DC Resistance(DCR): 190mΩ
P1 = 2.54-2*5P简牛: Connector Type:IDC Header Pitch:2.54mm Number of Positions or Pins:2x5P Current Rating:1A Holder Type:Through Hole Row Spacing:2.54mm Number of Rows:2 Number of PINs Per Row:5 Contact Material:Brass Contact Plating:Gold Operating Temperature:-55℃~+105℃ Op; LCSC Part Name: 2.54mm 2x5P 排数:2 每排P数:5; Supplier Part: C5665; Manufacturer: BOOMELE(博穆精密); Supplier Footprint: 插件,P=2.54mm; JLCPCB Part Class: Extended Part; Datasheet: https://item.szlcsc.com/datasheet/2.54-2*5P%25E7%25AE%2580%25E7%2589%259B/6118.html; Supplier: LCSC; Connector Type: IDC Header; Pitch: 2.54mm; Number of Positions or Pins: 2x5P; Current Rating: 1A; Holder Type: Through Hole; Row Spacing: 2.54mm; Number of Rows: 2; Number of PINs Per Row: 5; Contact Material: Brass; Contact Plating: Gold; Operating Temperature: -55℃~+105℃; Color: Black
R1 = CRCW080597K6FKEA: Type:Thick Film Resistor Resistance:97.6kΩ Tolerance:±1% Tolerance:±1% Power(Watts):125mW Voltage-Supply(Max):150V Temperature Coefficient:±100ppm/℃ Temperature Coefficient:±100ppm/℃ Operating Temperature:-55℃~+155℃ Operating Temperature:-55℃~+155℃; LCSC Part Name: 厚膜电阻 97.6kΩ ±1% 125mW; Supplier Part: C2077571; Manufacturer: VISHAY(威世); Supplier Footprint: 0805; JLCPCB Part Class: Extended Part; Datasheet: https://item.szlcsc.com/datasheet/CRCW080597K6FKEA/2169158.html; Supplier: LCSC; Type: Thick Film Resistor; Tolerance: ±1%; Power(Watts): 125mW; Voltage-Supply(Max): 150V; Temperature Coefficient: ±100ppm/℃; Operating Temperature: -55℃~+155℃
R2 = CRCW080513K3FKEA: Type:Thick Film Resistors Resistance:13.3kΩ Tolerance:±1% Tolerance:±1% Power(Watts):125mW Temperature Coefficient:±100ppm/℃ Temperature Coefficient:±100ppm/℃ Operating Temperature:-55℃~+155℃ Operating Temperature:-55℃~+155℃; LCSC Part Name: 厚膜电阻 13.3kΩ ±1% 125mW; Supplier Part: C4359485; Manufacturer: VISHAY(威世); Supplier Footprint: 0805; JLCPCB Part Class: Extended Part; Datasheet: https://item.szlcsc.com/datasheet/CRCW080513K3FKEA/4930395.html; Supplier: LCSC; Type: Thick Film Resistors; Tolerance: ±1%; Power(Watts): 125mW; Temperature Coefficient: ±100ppm/℃; Operating Temperature: -55℃~+155℃
U2 = REF5025IDR: Manufacturer: TI; Supplier: LCSC; Supplier Part: C544535
U12 = TPS54202DDCR: Function:Step-down type Output Type:Adjustable Voltage - Supply:4.5V~28V Voltage - Supply:4.5V~28V Output Voltage:- Output Voltage:- Output Current:2A Frequency - Switching:500kHz Frequency - Switching:500kHz Operating Temperature:-40℃~+125℃@(TJ) Operatin; LCSC Part Name: 4.5V至28V输入、2A输出、低EMI同步降压转换器; Supplier Part: C191884; Manufacturer: TI(德州仪器); Supplier Footprint: SOT-23-6; JLCPCB Part Class: Extended Part; Datasheet: https://www.ti.com/cn/lit/gpn/tps54202; Supplier: LCSC; Function: Step-down type; Output Type: Adjustable; Voltage - Supply: 4.5V~28V; Output Current: 2A; Frequency - Switching: 500kHz; Operating Temperature: -40℃~+125℃@(TJ); Synchronous Rectifier: Yes; Number of Outputs: 1; Topology: Step-down; Switch tube (built-in/external): Built-in
U14 U15 = TPS7A2033PDBVR: Output Type:Fixed Maximum Input Voltage:6V Output Voltage:3.3V Output Voltage:3.3V Output Current:300mA Dropout Voltage:140mV@(300mA) standby current:15uA Feature:防静电保护；Soft Start；浪涌保护；低ESR；Thermal Protection(TSD)；欠压闭锁；Overcurrent Protection(OCP)；带使能；防倒灌; LCSC Part Name: 具有高 PSRR 的 300mA、超低噪声、低 IQ、低压降 (LDO) 线性稳压器; Supplier Part: C2862740; Manufacturer: TI(德州仪器); Supplier Footprint: SOT-23-5; JLCPCB Part Class: Extended Part; Datasheet: https://www.ti.com/cn/lit/gpn/tps7a20; Supplier: LCSC; Output Type: Fixed; Maximum Input Voltage: 6V; Output Voltage: 3.3V; Output Current: 300mA; Dropout Voltage: 140mV@(300mA); standby current: 15uA; Feature: 防静电保护；Soft Start；浪涌保护；低ESR；Thermal Protection(TSD)；欠压闭锁；Overcurrent Protection(OCP)；带使能；防倒灌; Operating Temperature: -40℃~+125℃@(Tj); Output Polarity: Positive electrode; Number of Outputs: 1

## Nets
12VEURO: D1.2(A) P1.1 P1.2
+3V3: C26.1 D3.2(C) D4.2(C) D5.2(C) H4.7 U1.25(V33) U1.27(V33) U1.29(V33) U3.20(DVDD)
+3V3_AUDIO: C14.2 C24.2 C25.2 C30.2 C31.2 U3.1(CPVDD) U3.8(AVDD) U15.5(OUT)
+3V3_PREC: C11.2 C15.2 C18.1 C19.2 U2.2(VIN) U6.1(VDD) U14.5(OUT)
+5V: C7.2 C8.2 C9.2 C12.2 H3.4 L3.2 R1.2 U1.57(VCC) U1.58(VCC) U14.1(IN) U14.3(EN) U15.1(IN) U15.3(EN)
+12V: C1.1 C3.2 C5.2 C22.1 C36.1 H3.1 L1.2 U7.8(V+) U12.3(VIN) U16.8(V+)
-12V: C2.2 C4.1 C23.1 C35.1 H3.2 L2.2 U7.4(V-) U16.4(V-)
-12VEURO: D2.1(C) P1.9 P1.10
GND: C1.2 C2.1 C3.1 C4.2 C5.1 C8.1 C9.1 C10.1 C11.1 C12.1 C13.1 C14.1 C15.1 C16.1 C17.1 C18.2 C19.1 C20.1 C21.1 C22.2 C23.2 C24.1 C25.1 C26.2 C28.1 C29.1 C30.1 C31.1 C32.1 C33.2 C35.2 C36.2 C37.1 C38.1 C39.1 D3.1(A) D4.1(A) D5.1(A) H2.1 H2.4 H3.3 H3.5 H3.8 H4.1 H4.4 H4.6 H4.8 H9.1 H9.3 H9.7 H9.9 H9.12 P1.3 P1.4 P1.5 P1.6 P1.7 P1.8 R2.1 R4.1 R6.1 R10.1 R12.1 U1.2(GND) U1.26(GND) U1.28(GND) U1.30(GND) U1.32(GND) U1.59(GND) U1.60(GND) U2.4(GND) U3.3(CPGND) U3.9(AGND) U3.10(DEMP) U3.11(FLT) U3.12(SCK) U3.16(FMT) U3.19(DGND) U12.1(GND) U14.2(GND) U15.2(GND)
A-OUT-L: H2.3 R9.2 U16.1(OUTA)
A-OUT-R: H2.2 R11.2 U16.7(OUTB)
CLK-IN: C38.2 D3.3(A/C) H9.8 U1.10(PC3)
CV-IN-A: C37.2 D4.3(A/C) H9.5 U1.9(PA0)
CV-IN-B: C39.2 D5.3(A/C) H9.6 U1.12(PA1)
CV-OUT-A: H3.6 R3.2 U7.1(OUTA)
CV-OUT-B: H3.7 R5.2 U7.7(OUTB)
DAC-SPI-CS: U1.22(PB1) U6.5(SYNC#)
DAC-SPI-MOSI: U1.54(PB15) U6.7(DIN)
DAC-SPI-SCLK: U1.56(PB13) U6.6(SCLK)
GATE-OUT-A: H9.11 U1.14(PA3)
GATE-OUT-B: H9.10 U1.15(PA6)
I2S3_BCK: U1.37(PB3) U3.13(BCK)
I2S3_SD: U1.35(PB5) U3.14(DIN)
I2S3_WS: U1.44(PA15) U3.15(LRCK)
OLED-DC: U1.7(PC2)
OLED-RES: U1.8(PC1)
OLED-SPI-CS: U1.55(PB12)
OLED-SPI-MOSI: U1.18(PA7)
OLED-SPI-SCLK: U1.16(PA5)
U12-BOOT: C6.2 U12.6(BOOT)
U12-FB: C7.1 R1.1 R2.2 U12.4(FB)
U12-SW: C6.1 L3.1 U12.2(SW)
USR-ENC-A: H4.2 U1.36(PB6)
USR-ENC-B: H4.3 U1.33(PB7)
USR-ENC-SW: H4.5 U1.38(PB4)
USR-POT-1: H9.4 U1.5(PC0)
VREF: C16.2 C20.2 C21.2 H9.2 U2.6(VOUT) U6.2(VREF)
~MUTE: U1.51(PC6) U3.17(XSMT)
$2N2806: U6.3(VOUTB) U7.3(INA+)
$2N2810: R3.1 R4.2 U7.2(INA-)
$2N2813: R5.1 R6.2 U7.6(INB-)
$2N2826: R11.1 R12.2 U16.6(INB-)
$2N2830: R8.2 U3.6(OUTL)
$2N2831: C33.1 R8.1 R9.1 R10.2 U16.2(INA-) U16.3(INA+)
$2N2832: R7.2 U3.7(OUTR)
$2N2839: C27.2 U3.2(CAPP)
$2N2840: C27.1 U3.4(CAPM)
$2N2842: C28.2 U3.5(VNEG)
$2N2847: C32.2 R7.1 U16.5(INB+)
$2N2851: C29.2 U3.18(LDOO)
$2N7056: U6.4(VOUTA) U7.5(INB+)
$4N1443: D2.2(A) F2.1
$4N1444: D1.1(C) F1.1
$4N1447: F2.2 L2.1
$4N1449: F1.2 L1.1
$4N1457: C17.2 U2.5(TRIM/NR)
$4N3246: C13.2 U15.4(NC)
$4N3248: C10.2 U14.4(NC)

Not connected (* = marked no-connect by the designer): U1 1(VB) 3(PC14) 4(PC13) 6(PC15) 11(PA2) 13(PA4) 17(PC4) 19(PB0) 20(PC5) 21(PB2) 23(PB11) 24(PB10) 31(PB9) 34(PB8) 39(PC12) 40(PD2) 41(PC10) 42(PC11) 43(PA12) 45(PA10) 46(PA11) 47(PA8) 48(PA9) 49(PC8) 50(PC9) 52(PC7) 53(PB14); U2 1(DNC) 3(TEMP) 7(NC) 8(DNC); U6 8(GND); U12 5(EN)
